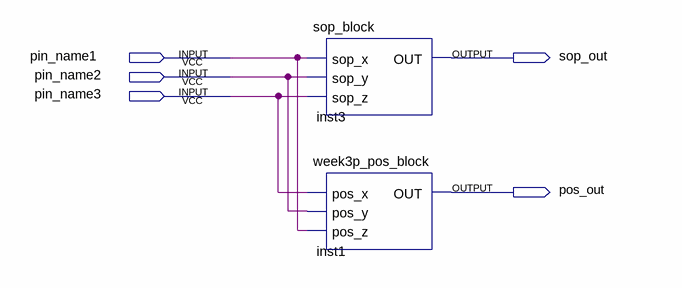
[diagram p0: schematic sheet]
// Quartus schematic week3p_main_block.bdf as structural Verilog: 2 symbols, 5 pins
module week3p_main_block (
  input  pin_name1,
  input  pin_name2,
  input  pin_name3,
  output sop_out,
  output pos_out
);

  sop_block inst3 (.sop_x(pin_name1), .sop_y(pin_name2), .sop_z(pin_name3), .OUT(sop_out));
  week3p_pos_block inst1 (.pos_x(pin_name3), .pos_y(pin_name2), .pos_z(pin_name1), .OUT(pos_out));
endmodule
